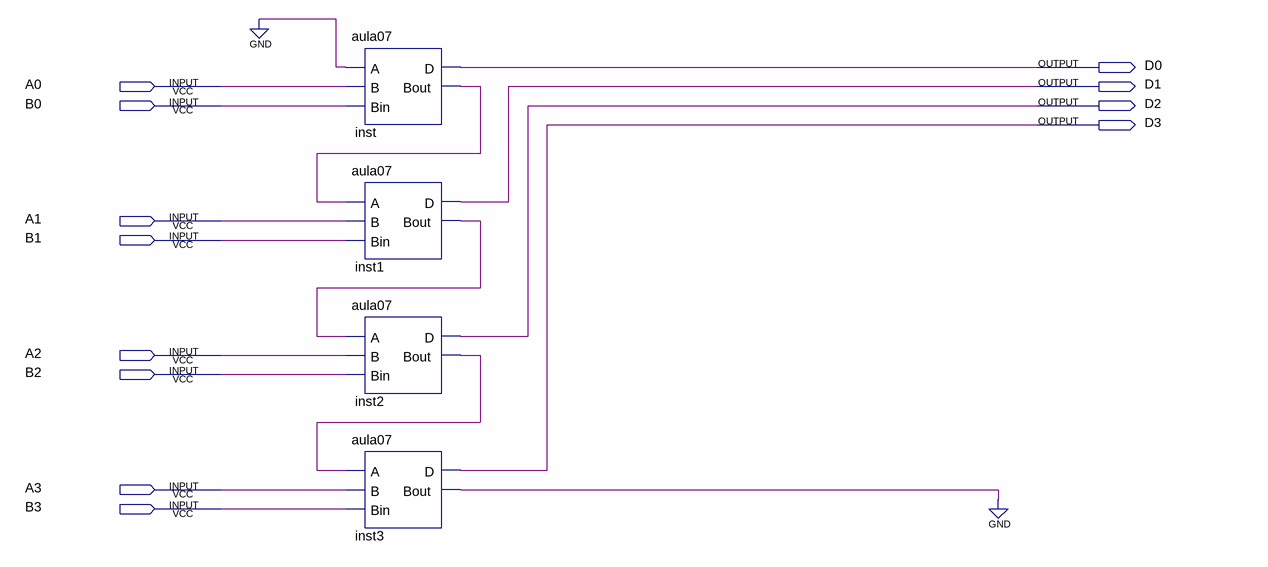
[diagram p0: schematic sheet]
// Quartus schematic sub4.bdf as structural Verilog: 4 symbols, 12 pins
module sub4 (
  input  A0,
  input  B0,
  input  A1,
  input  B1,
  input  A2,
  input  B2,
  input  A3,
  input  B3,
  output D0,
  output D1,
  output D2,
  output D3
);

  wire inst1_bout, inst2_bout, inst3_bout, inst_bout;

  aula07 inst (.A(1'b0), .B(A0), .Bin(B0), .D(D0), .Bout(inst_bout));
  aula07 inst1 (.A(inst_bout), .B(A1), .Bin(B1), .D(D1), .Bout(inst1_bout));
  aula07 inst2 (.A(inst1_bout), .B(A2), .Bin(B2), .D(D2), .Bout(inst2_bout));
  aula07 inst3 (.A(inst2_bout), .B(A3), .Bin(B3), .D(D3), .Bout(inst3_bout));
  // also tied to GND on the sheet: inst3_bout
endmodule
